# Altium project servo_pwr.PrjPcb
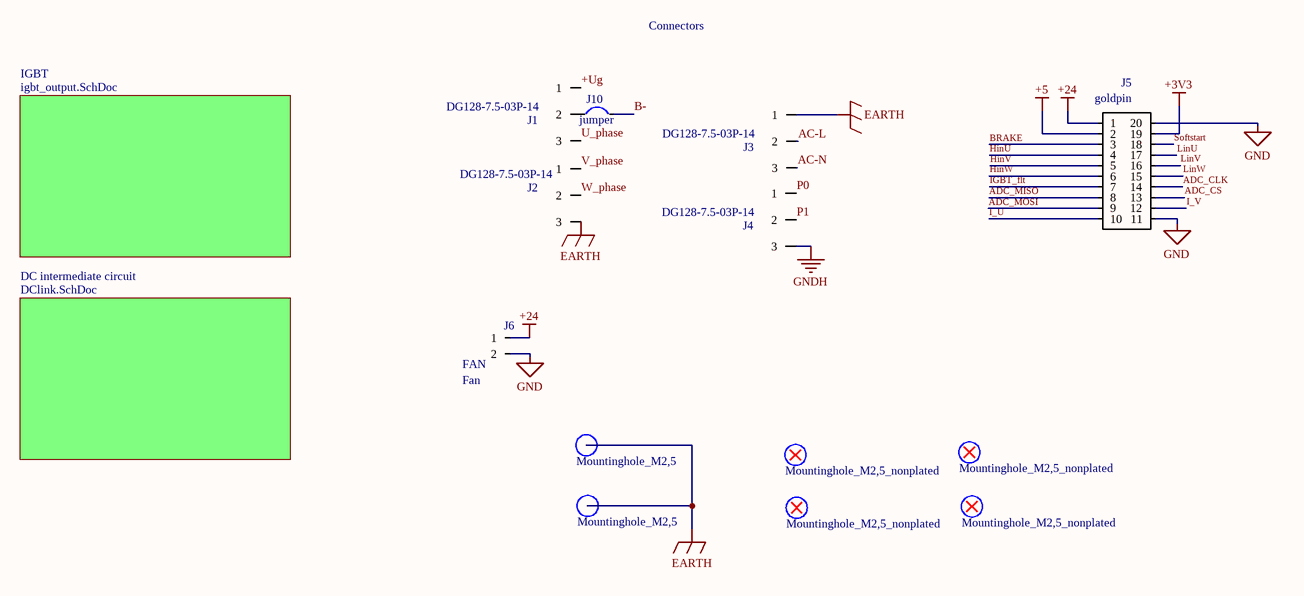
[diagram p0: servo_pwr.SchDoc]
3 sheets, 134 parts. Net scope: global (net labels, ports and power ports of the same name join across sheets).
Board file: servo_pwr.PcbDoc
Sheets:
  servo_pwr.SchDoc
    IGBT = igbt_output.SchDoc
    DC intermediate circuit = DClink.SchDoc

## Sheet servo_pwr.SchDoc: Servo power board
size A4; Organization: W Burdecki; Address1: github.com/wiciu15; Address2: All rights reserved; DocumentNumber: 1; Revision: 1.0; SheetNumber: 1; SheetTotal: 3

### Parts
J1  DG128-7.5-03P-14  [DG128-7.5-03P-14]
J2  DG128-7.5-03P-14  [DG128-7.5-03P-14]
J3  DG128-7.5-03P-14  [DG128-7.5-03P-14]
J4  DG128-7.5-03P-14  [DG128-7.5-03P-14]
J5  goldpin  [goldpin 2x10]
J6  FAN  [JST XH 2pin]
J10  jumper  [Jumper]
MH3  Mountinghole_M2,5  [Mountinghole M2,5]
MH4  Mountinghole_M2,5  [Mountinghole M2,5]
MH5  Mountinghole_M2,5_nonplated  [Mountinghole M2,5 non plated]
MH6  Mountinghole_M2,5_nonplated  [Mountinghole M2,5 non plated]
MH7  Mountinghole_M2,5_nonplated  [Mountinghole M2,5 non plated]
MH8  Mountinghole_M2,5_nonplated  [Mountinghole M2,5 non plated]

### Sub-sheets
DC intermediate circuit = DClink.SchDoc: no entries
IGBT = igbt_output.SchDoc: no entries

### Nets
+3V3: J5.19
+5: J5.2
+24: J5.1 J6.1
EARTH: J2.3 J3.1 MH3.1 MH4.1
GND: J5.11 J5.20 J6.2
GNDH: J4.3
+Ug: J1.1
AC-L: J3.2
AC-N: J3.3
ADC_CLK: J5.14
ADC_CS: J5.13
ADC_MISO: J5.8
ADC_MOSI: J5.9
B-: J10.1
BRAKE: J5.3
HinU: J5.4
HinV: J5.5
HinW: J5.6
I_U: J5.10
I_V: J5.12
IGBT_flt: J5.7
LinU: J5.17
LinV: J5.16
LinW: J5.15
P0: J4.1
P1: J4.2
Softstart: J5.18
U_phase: J1.3
V_phase: J2.1
W_phase: J2.2
NetJ1_2: J1.2 J10.2

Not connected (* = marked no-connect by the designer): MH5 1*; MH6 1*; MH7 1*; MH8 1*

### Notes on the sheet
- Connectors
- (near J6) Fan
- Title
- Size:
- Date:
- A4
- Number:
- Time:
- Revision:
- Sheet
- of
- File:

### Library data of the parts
J6 = JST 2pin

## Sheet igbt_output.SchDoc: Servo power board
size A3; Organization: W Burdecki; Address1: github.com/wiciu15; Address2: All rights reserved; DocumentNumber: 2; Revision: 1.0; SheetNumber: 2; SheetTotal: 3
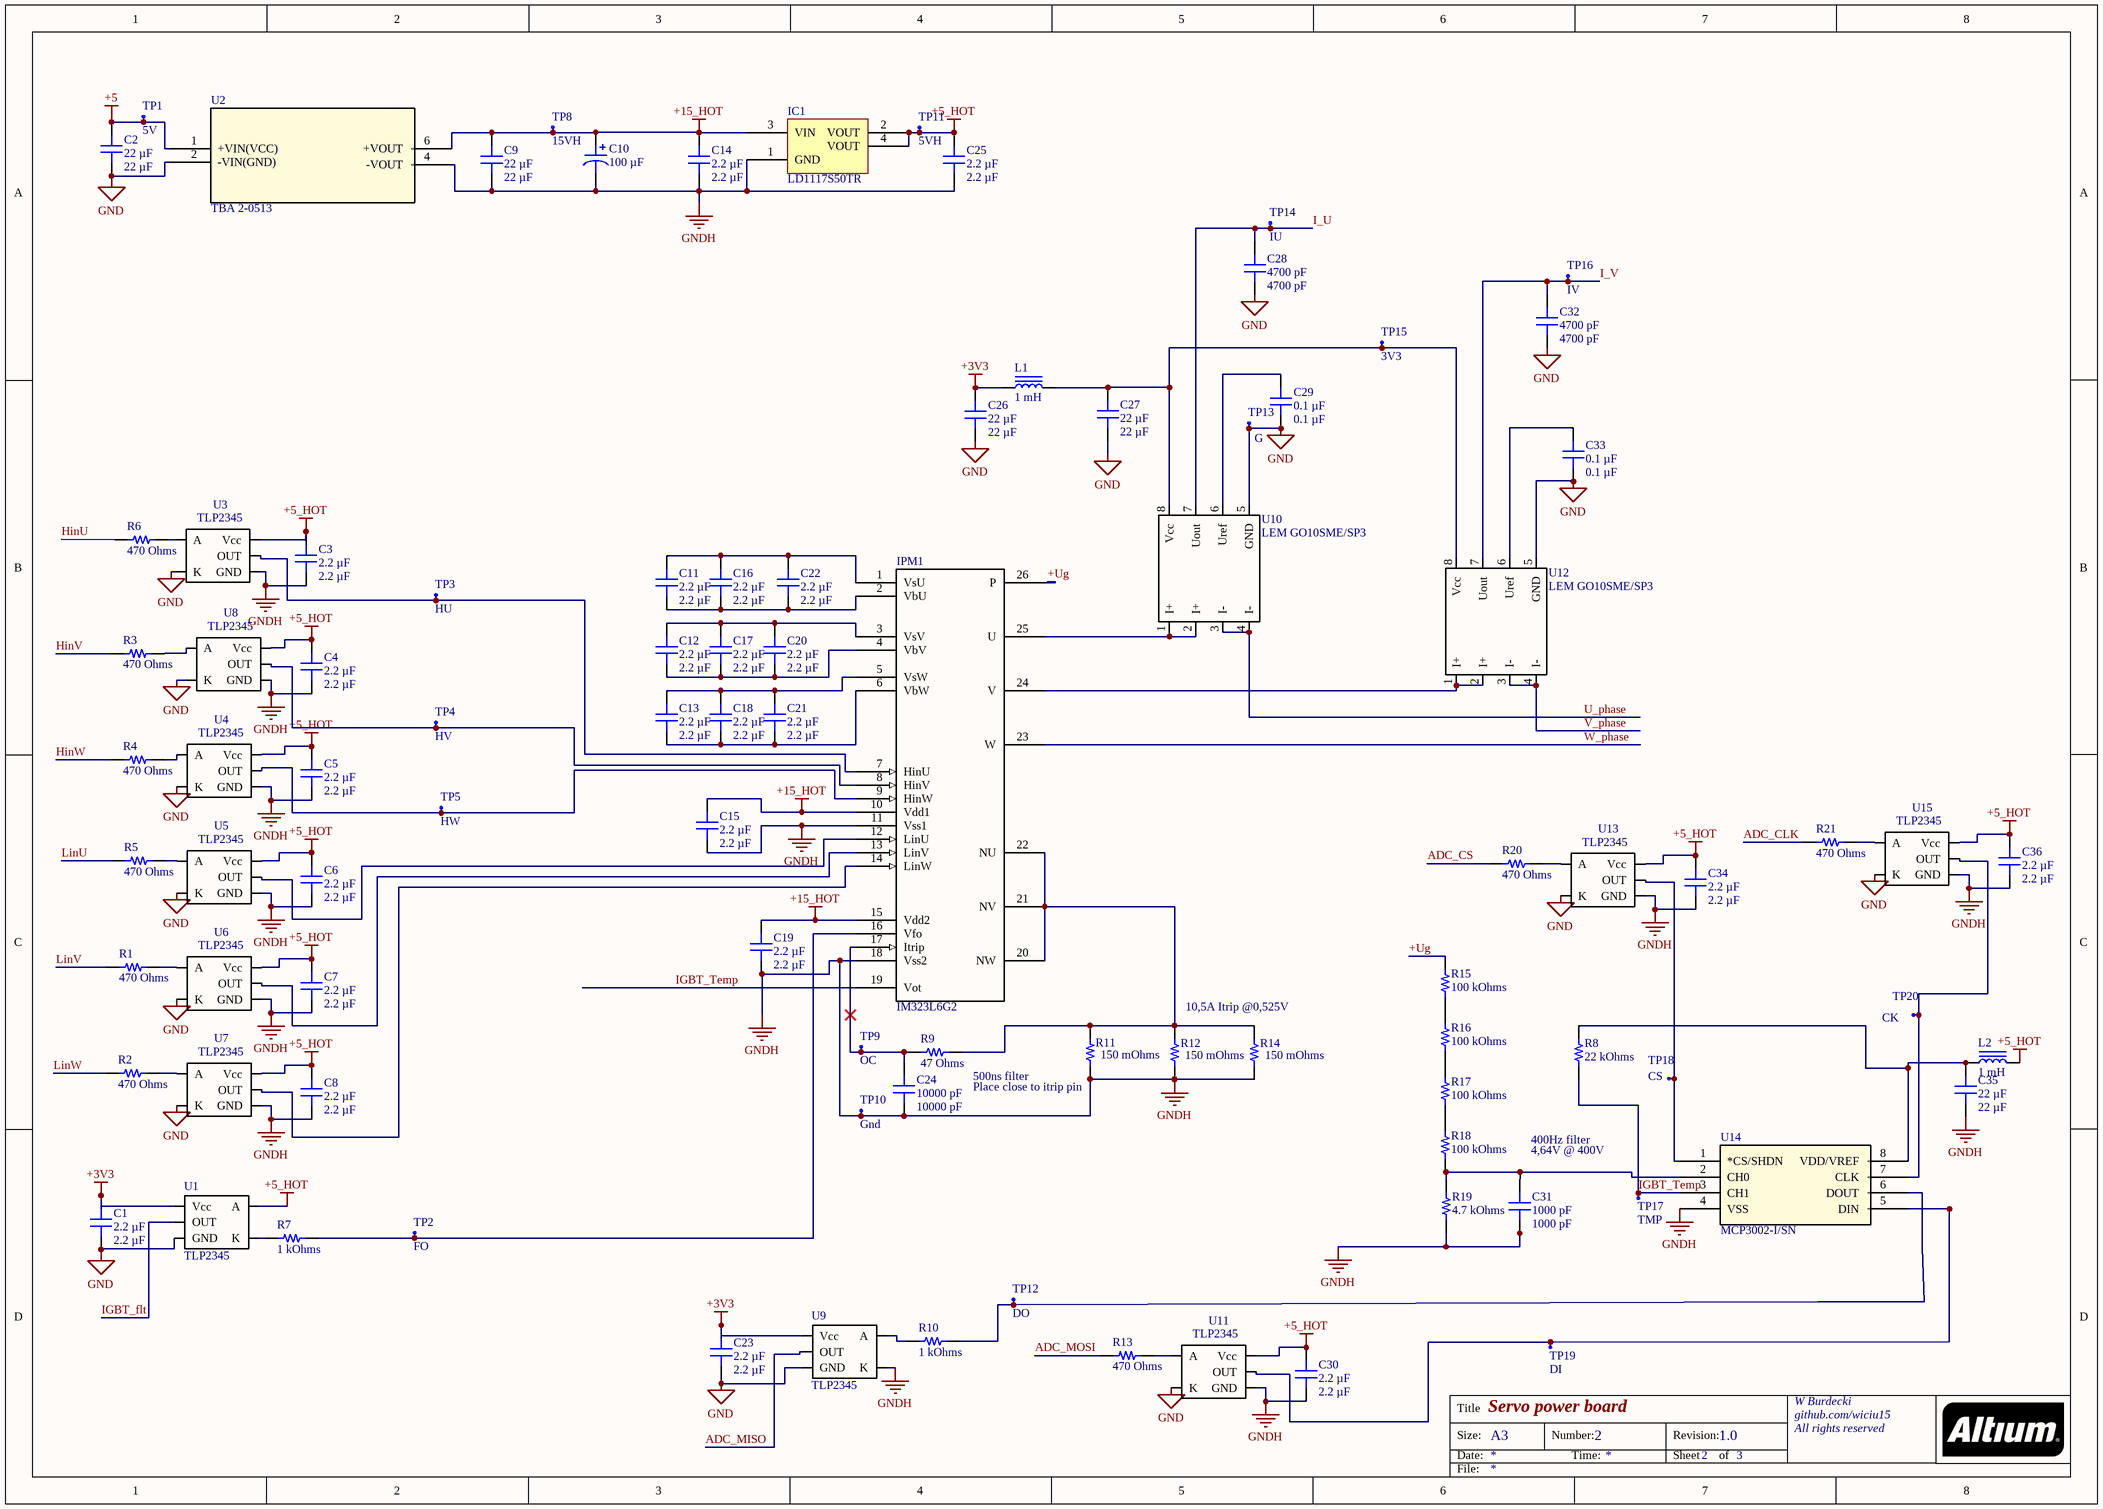
[diagram p1: igbt_output.SchDoc]

### Parts
C1  2.2 µF  [0805 wide]
C2  22 µF  [CAP 0805_2012]
C3  2.2 µF  [0805 wide]
C4  2.2 µF  [0805 wide]
C5  2.2 µF  [0805 wide]
C6  2.2 µF  [0805 wide]
C7  2.2 µF  [0805 wide]
C8  2.2 µF  [0805 wide]
C9  22 µF  [CAP 0805_2012]
C10  100 µF  [CAP AL TH D8 L3.5 H12.5]
C11  2.2 µF  [0805 wide]
C12  2.2 µF  [0805 wide]
C13  2.2 µF  [0805 wide]
C14  2.2 µF  [CAP 0805_2012]
C15  2.2 µF  [CAP 0805_2012]
C16  2.2 µF  [0805 wide]
C17  2.2 µF  [0805 wide]
C18  2.2 µF  [0805 wide]
C19  2.2 µF  [CAP 0805_2012]
C20  2.2 µF  [0805 wide]
C21  2.2 µF  [0805 wide]
C22  2.2 µF  [0805 wide]
C23  2.2 µF  [0805 wide]
C24  10000 pF  [CAP 0805_2012]
C25  2.2 µF  [CAP 0805_2012]
C26  22 µF  [CAP 0805_2012]
C27  22 µF  [0805 wide]
C28  4700 pF  [0805 wide]
C29  0.1 µF  [0805 wide]
C30  2.2 µF  [0805 wide]
C31  1000 pF  [CAP 0805_2012]
C32  4700 pF  [0805 wide]
C33  0.1 µF  [0805 wide]
C34  2.2 µF  [0805 wide]
C35  22 µF  [CAP 0805_2012]
C36  2.2 µF  [0805 wide]
IC1  LD1117S50TR  [ST SOT-223]
IPM1  IM323L6G2  [IM323L6G2]
L1  1 mH  [BOURNS SRR6028]
L2  1 mH  [BOURNS SRR6028]
R1  470 Ohms  [RES 0805_2012]
R2  470 Ohms  [RES 0805_2012]
R3  470 Ohms  [RES 0805_2012]
R4  470 Ohms  [RES 0805_2012]
R5  470 Ohms  [RES 0805_2012]
R6  470 Ohms  [RES 0805_2012]
R7  1 kOhms  [RES 0805_2012]
R8  22 kOhms  [RES 0805_2012]
R9  47 Ohms  [RES 0805_2012]
R10  1 kOhms  [RES 0805_2012]
R11  150 mOhms  [RES 2512_6432]
R12  150 mOhms  [RES 2512_6432]
R13  470 Ohms  [RES 0805_2012]
R14  150 mOhms  [RES 2512_6432]
R15  100 kOhms  [RES 1206_3216]
R16  100 kOhms  [RES 1206_3216]
R17  100 kOhms  [RES 1206_3216]
R18  100 kOhms  [RES 1206_3216]
R19  4.7 kOhms  [RES 1206_3216]
R20  470 Ohms  [RES 0805_2012]
R21  470 Ohms  [RES 0805_2012]
TP1  5V  [Testpoint1,2mm]
TP2  FO  [Testpoint1,2mm]
TP3  HU  [Testpoint1,2mm]
TP4  HV  [Testpoint1,2mm]
TP5  HW  [Testpoint1,2mm]
TP8  15VH  [Testpoint1,2mm]
TP9  OC  [Testpoint1,2mm]
TP10  Gnd  [Testpoint1,2mm]
TP11  5VH  [Testpoint1,2mm]
TP12  DO  [Testpoint1,2mm]
TP13  G  [Testpoint1,2mm]
TP14  IU  [Testpoint1,2mm]
TP15  3V3  [Testpoint1,2mm]
TP16  IV  [Testpoint1,2mm]
TP17  TMP  [Testpoint1,2mm]
TP18  CS  [Testpoint1,2mm]
TP19  DI  [Testpoint1,2mm]
TP20  CK  [Testpoint1,2mm]
U1  TLP2345  [TLP2345]
U2  TBA 2-0513  [TBA 2_SINGLE_TRP]
U3  TLP2345  [TLP2345]
U4  TLP2345  [TLP2345]
U5  TLP2345  [TLP2345]
U6  TLP2345  [TLP2345]
U7  TLP2345  [TLP2345]
U8  TLP2345  [TLP2345]
U9  TLP2345  [TLP2345]
U10  LEM GO10SME/SP3  [TSOP127P600X160-8N]
U11  TLP2345  [TLP2345]
U12  LEM GO10SME/SP3  [TSOP127P600X160-8N]
U13  TLP2345  [TLP2345]
U14  MCP3002-I/SN  [SOIC8-N_MC_MCH]
U15  TLP2345  [TLP2345]

### Nets
+3V3: C1.2 C23.2 C26.2 L1.1 U1.6(Vcc) U9.6(Vcc)
+5: C2.2 TP1.1 U2.1(+VIN(VCC))
+5_HOT: C3.2 C4.2 C5.2 C6.2 C7.2 C8.2 C25.2 C30.2 C34.2 C36.2 IC1.2(VOUT) IC1.4(VOUT) L2.2 TP11.1 U1.1(A) U3.6(Vcc) U4.6(Vcc) U5.6(Vcc) U6.6(Vcc) U7.6(Vcc) U8.6(Vcc) U11.6(Vcc) U13.6(Vcc) U15.6(Vcc)
+15_HOT: C9.2 C10.1 C14.2 C15.2 C19.2 IC1.3(VIN) IPM1.10(Vdd1) IPM1.15(Vdd2) TP8.1 U2.6(+VOUT)
GND: C1.1 C2.1 C23.1 C26.1 C27.1 C28.1 C29.1 C32.1 C33.1 TP13.1 U1.4(GND) U2.2(-VIN(GND)) U3.3(K) U4.3(K) U5.3(K) U6.3(K) U7.3(K) U8.3(K) U9.4(GND) U10.5(GND) U11.3(K) U12.5(GND) U13.3(K) U15.3(K)
GNDH: C3.1 C4.1 C5.1 C6.1 C7.1 C8.1 C9.1 C10.2 C14.1 C15.1 C19.1 C24.1 C25.1 C30.1 C31.1 C34.1 C35.1 C36.1 IC1.1(GND) IPM1.11(Vss1) IPM1.18(Vss2) R11.1 R12.1 R14.1 R19.1 TP10.1 U2.4(-VOUT) U3.4(GND) U4.4(GND) U5.4(GND) U6.4(GND) U7.4(GND) U8.4(GND) U9.3(K) U11.4(GND) U13.4(GND) U14.4(VSS) U15.4(GND)
+Ug: IPM1.26(P) R15.2
ADC_CLK: R21.1
ADC_CS: R20.1
ADC_MISO: U9.5(OUT)
ADC_MOSI: R13.1
HinU: R6.1
HinV: R3.1
HinW: R4.1
I_U: C28.2 TP14.1 U10.7(Uout)
I_V: C32.2 TP16.1 U12.7(Uout)
IGBT_flt: U1.5(OUT)
IGBT_Temp: IPM1.19(Vot) R8.1 TP17.1 U14.3(CH1)
LinU: R5.1
LinV: R1.1
LinW: R2.1
U_phase: U10.3(I-) U10.4(I-)
V_phase: U12.3(I-) U12.4(I-)
W_phase: IPM1.23(W)
NetC11_1: C11.1 C16.1 C22.1 IPM1.2(VbU)
NetC11_2: C11.2 C16.2 C22.2 IPM1.1(VsU)
NetC12_1: C12.1 C17.1 C20.1 IPM1.4(VbV)
NetC12_2: C12.2 C17.2 C20.2 IPM1.3(VsV)
NetC13_1: C13.1 C18.1 C21.1 IPM1.6(VbW)
NetC13_2: C13.2 C18.2 C21.2 IPM1.5(VsW)
NetC24_2: C24.2 IPM1.17(Itrip) R9.1 TP9.1
NetC27_2: C27.2 L1.2 TP15.1 U10.8(Vcc) U12.8(Vcc)
NetC29_2: C29.2 U10.6(Uref)
NetC31_2: C31.2 R18.1 R19.2 U14.2(CH0)
NetC33_2: C33.2 U12.6(Uref)
NetC35_2: C35.2 L2.1 R8.2 U14.8(VDD/VREF)
NetIPM1_7: IPM1.7(HinU) TP3.1 U3.5(OUT)
NetIPM1_8: IPM1.8(HinV) TP4.1 U8.5(OUT)
NetIPM1_9: IPM1.9(HinW) TP5.1 U4.5(OUT)
NetIPM1_12: IPM1.12(LinU) U5.5(OUT)
NetIPM1_13: IPM1.13(LinV) U6.5(OUT)
NetIPM1_14: IPM1.14(LinW) U7.5(OUT)
NetIPM1_16: IPM1.16(Vfo) R7.2 TP2.1
NetIPM1_20: IPM1.20(NW) IPM1.21(NV) IPM1.22(NU) R9.2 R11.2 R12.2 R14.2
NetIPM1_24: IPM1.24(V) U12.1(I+) U12.2(I+)
NetIPM1_25: IPM1.25(U) U10.1(I+) U10.2(I+)
NetR1_2: R1.2 U6.1(A)
NetR2_2: R2.2 U7.1(A)
NetR3_2: R3.2 U8.1(A)
NetR4_2: R4.2 U4.1(A)
NetR5_2: R5.2 U5.1(A)
NetR6_2: R6.2 U3.1(A)
NetR7_1: R7.1 U1.3(K)
NetR10_1: R10.1 U9.1(A)
NetR10_2: R10.2 TP12.1 U14.6(DOUT)
NetR13_2: R13.2 U11.1(A)
NetR15_1: R15.1 R16.2
NetR16_1: R16.1 R17.2
NetR17_1: R17.1 R18.2
NetR20_2: R20.2 U13.1(A)
NetR21_2: R21.2 U15.1(A)
NetTP18_1: TP18.1 U13.5(OUT) U14.1(*CS/SHDN)
NetTP19_1: TP19.1 U11.5(OUT) U14.5(DIN)
NetTP20_1: TP20.1 U14.7(CLK) U15.5(OUT)

### Notes on the sheet
- 10,5A Itrip @0,525V
- 500ns filter
- (near R11) Place close to itrip pin
- 4,64V @ 400V
- 400Hz filter
- Title
- Size:
- Date:
- A3
- Number:
- Time:
- Revision:
- Sheet
- of
- File:

### Library data of the parts
C1 C3-C8 C11-C23 C25 C30 C34 C36 = C2012X7R1V225K125AB: CAP CER 2.2UF 35V X7R 0805; manufacturer: TDK Corporation; Tolerance: ±10%; Part Number: C2012X7R1V225K125AB; Value: 2.2 µF; Applications: General Purpose; Capacitance: 2.2 µF; componentlink1description: Datasheet; componentlink1url: https://product.tdk.com/info/en/catalog/datasheets/mlcc_commercial_general_en.pdf?ref_disty=digikey; componentlink2description: DigiKey Link; componentlink2url: https://www.digikey.com/en/products/detail/tdk-corporation/C2012X7R1V225K125AB/2732986; Device Package: 0805 (2012 Metric); lastupdated: 03.01.2023 20:10:54; Lifecycle Status: Active; Minimum Order: 1; Mounting Type: Surface Mount, MLCC; Operating Temperature: -55°C ~ 125°C; Package / Case: 0805 (2012 Metric); packaging: TapeAndReel; partid: 3412; Part Status: Active; price: 0.12; series: C; Size / Dimension: 0.079" L x 0.049" W (2.00mm x 1.25mm); Supplier 1: DigiKey; Supplier Part Number 1: 445-7551-1-ND; Temperature Coefficient: X7R; Thickness (Max): 0.057" (1.45mm); Voltage - Rated: 35V; Features: Low ESL
C2 C9 C26 C27 C35 = CL21A226KOQNNNG: CAP CER 22UF 16V X5R 0805; manufacturer: Samsung Electro-Mechanics; Tolerance: ±10%; Part Number: CL21A226KOQNNNG; Value: 22 µF; Applications: General Purpose; Capacitance: 22 µF; componentlink1description: Datasheet; componentlink1url: //media.digikey.com/pdf/Data%20Sheets/Samsung%20PDFs/CL21A226KOQNNNG_Spec.pdf; componentlink2description: DigiKey Link; componentlink2url: https://www.digikey.com/en/products/detail/samsung-electro-mechanics/CL21A226KOQNNNG/3894433; Device Package: 0805 (2012 Metric); lastupdated: 03.01.2023 20:10:55; Lifecycle Status: Active; Minimum Order: 1; Mounting Type: Surface Mount, MLCC; Operating Temperature: -55°C ~ 85°C; Package / Case: 0805 (2012 Metric); packaging: TapeAndReel; partid: 3000; Part Status: Active; price: 0.06; series: CL; Size / Dimension: 0.079" L x 0.049" W (2.00mm x 1.25mm); Supplier 1: DigiKey; Supplier Part Number 1: 1276-7092-1-ND; Temperature Coefficient: X5R; Thickness (Max): 0.055" (1.40mm); Voltage - Rated: 16V
C10 = EEU-TA1E101: CAP ALUM 100UF 20% 25V RADIAL; manufacturer: Panasonic Electronic Components; Impedance: 130 mOhms; Lifetime @ Temp.: 2000 Hrs @ 125°C; Polarization: Polar; Ripple Current @ High Frequency: 500 mA @ 100 kHz; Ripple Current @ Low Frequency: 325 mA @ 120 Hz; Part Number: EEU-TA1E101; Applications: General Purpose; Capacitance: 100 µF; componentlink1description: Datasheet; componentlink1url: http://industrial.panasonic.com/www-cgi/jvcr13pz.cgi?E+PZ+3+ABA0028+EEUTA1E101+8+WW; componentlink2description: DigiKey Link; componentlink2url: https://www.digikey.com/en/products/detail/panasonic-electronic-components/EEU-TA1E101/2689893; Device Package: Radial, Can; Height - Seated (Max): 0.492" (12.50mm); lastupdated: 02.01.2023 21:00:54; Lead Spacing: 0.138" (3.50mm); Lifecycle Status: Active; Minimum Order: 1; Mounting Type: Through Hole; Operating Temperature: -40°C ~ 125°C; Package / Case: Radial, Can; packaging: Bulk; partid: 7202; Part Status: Active; price: 0.31; series: TA; Size / Dimension: 0.315" Dia (8.00mm); Supplier 1: DigiKey; Supplier Part Number 1: P19501-ND; Tolerance: ±20%; value: 100 µF; Voltage - Rated: 25 V
C24 = C0805C103K5RECAUTO: CAP CER 0805 10NF 50V X7R 10%; manufacturer: KEMET; Part Number: C0805C103K5RECAUTO; Value: 10000 pF; Applications: Automotive, ESD Protection; Capacitance: 10000 pF; componentlink1description: Datasheet; componentlink1url: https://api.kemet.com/component-edge/download/datasheet/C0805C103K5RECAUTO.pdf; componentlink2description: DigiKey Link; componentlink2url: https://www.digikey.com/en/products/detail/kemet/C0805C103K5RECAUTO/8640479; Device Package: 0805 (2012 Metric); lastupdated: 03.01.2023 20:10:42; Lifecycle Status: Active; Minimum Order: 1; Mounting Type: Surface Mount, MLCC; Operating Temperature: -55°C ~ 125°C; Package / Case: 0805 (2012 Metric); packaging: TapeAndReel; partid: 8498; Part Status: Active; price: 0.04; Ratings: AEC-Q200; series: ESD SMD Auto X7R; Size / Dimension: 0.079" L x 0.049" W (2.00mm x 1.25mm); Supplier 1: DigiKey; Supplier Part Number 1: 399-17885-1-ND; Temperature Coefficient: X7R; Thickness (Max): 0.035" (0.88mm); Tolerance: ±10%; Voltage - Rated: 50V
C28 C32 = C0805C472K5RECAUTO: CAP CER 0805 4.7NF 50V X7R 10%; manufacturer: KEMET; Part Number: C0805C472K5RECAUTO; Value: 4700 pF; Applications: Automotive, ESD Protection; Capacitance: 4700 pF; componentlink1description: Datasheet; componentlink1url: https://api.kemet.com/component-edge/download/datasheet/C0805C472K5RECAUTO.pdf; componentlink2description: DigiKey Link; componentlink2url: https://www.digikey.com/en/products/detail/kemet/C0805C472K5RECAUTO/8640478; Device Package: 0805 (2012 Metric); lastupdated: 03.01.2023 20:10:48; Lifecycle Status: Active; Minimum Order: 1; Mounting Type: Surface Mount, MLCC; Operating Temperature: -55°C ~ 125°C; Package / Case: 0805 (2012 Metric); packaging: TapeAndReel; partid: 5836; Part Status: Active; price: 0.04; Ratings: AEC-Q200; series: ESD SMD Auto X7R; Size / Dimension: 0.079" L x 0.049" W (2.00mm x 1.25mm); Supplier 1: DigiKey; Supplier Part Number 1: 399-17884-1-ND; Temperature Coefficient: X7R; Thickness (Max): 0.035" (0.88mm); Tolerance: ±10%; Voltage - Rated: 50V
C29 C33 = CC0805MRX7R9BB104: CAP CER 0.1UF 50V X7R 0805; manufacturer: Yageo; Tolerance: ±20%; Part Number: CC0805MRX7R9BB104; Value: 0.1 µF; Applications: General Purpose; Capacitance: 0.1 µF; componentlink1description: Datasheet; componentlink1url: https://www.yageo.com/upload/media/product/productsearch/datasheet/mlcc/UPY-GPHC_X7R_6.3V-to-50V_18.pdf; componentlink2description: DigiKey Link; componentlink2url: https://www.digikey.com/en/products/detail/yageo/CC0805MRX7R9BB104/5884281; Device Package: 0805 (2012 Metric); lastupdated: 03.01.2023 20:10:56; Lifecycle Status: Active; Minimum Order: 1; Mounting Type: Surface Mount, MLCC; Operating Temperature: -55°C ~ 125°C; Package / Case: 0805 (2012 Metric); packaging: TapeAndReel; partid: 2475; Part Status: Active; price: 0.02; series: CC; Size / Dimension: 0.079" L x 0.049" W (2.00mm x 1.25mm); Supplier 1: DigiKey; Supplier Part Number 1: 311-4351-1-ND; Temperature Coefficient: X7R; Thickness (Max): 0.037" (0.95mm); Voltage - Rated: 50V
C31 = C0805X102J5HACAUTO: CAP CER 0805 1NF 50V ULTRA STABL; manufacturer: KEMET; Temperature Coefficient: X8R; Tolerance: ±5%; Part Number: C0805X102J5HACAUTO; Value: 1000 pF; Applications: Automotive, Boardflex Sensitive; Capacitance: 1000 pF; componentlink1description: Datasheet; componentlink1url: https://api.kemet.com/component-edge/download/datasheet/C0805X102J5HACAUTO.pdf; componentlink2description: DigiKey Link; componentlink2url: https://www.digikey.com/en/products/detail/kemet/C0805X102J5HACAUTO/8324462; Device Package: 0805 (2012 Metric); Features: Low ESL, Soft Termination, High Temperature; lastupdated: 03.01.2023 20:10:49; Lifecycle Status: Active; Minimum Order: 1; Mounting Type: Surface Mount, MLCC; Operating Temperature: -55°C ~ 150°C; Package / Case: 0805 (2012 Metric); packaging: TapeAndReel; partid: 5533; Part Status: Active; price: 0.03; Ratings: AEC-Q200; series: SMD Auto X8R HT150C Flex; Size / Dimension: 0.079" L x 0.049" W (2.00mm x 1.25mm); Supplier 1: DigiKey; Supplier Part Number 1: 399-16876-1-ND; Thickness (Max): 0.039" (0.98mm); Voltage - Rated: 50V
IC1 = LD1117S50TR: IC REG LINEAR 5V 800MA SOT223; Manufacturer: STMicroelectronics; Current - Quiescent (Iq): 10 mA; Number of Regulators: 1; Output Configuration: Positive; Output Type: Fixed; Protection Features: Over Current, Over Temperature; PSRR: 75dB (120Hz); Voltage Dropout (Max): 1.2V @ 800mA; Voltage - Input (Max): 15V; Part Number: LD1117S50TR; ComponentLink1Description: Datasheet; ComponentLink1URL: http://www.st.com/content/ccc/resource/technical/document/datasheet/99/3b/7d/91/91/51/4b/be/CD00000544.pdf/files/CD00000544.pdf/jcr:content/translations/en.CD00000544.pdf; ComponentLink2Description: DigiKey Link; ComponentLink2URL: https://www.digikey.com/en/products/detail/stmicroelectronics/LD1117S50TR/1038360; Current - Output: 800mA; LastUpdated: 02.01.2023 21:04:19; Lifecycle Status: Active; Minimum Order: 1; Mounting Type: Surface Mount; Operating Temperature: 0°C ~ 125°C; Package / Case: TO-261-4, TO-261AA; Packaging: TapeAndReel; Part Status: Active; Price: 0.25; Series: -; Supplier 1: DigiKey; Supplier Part Number 1: 497-6447-1-ND; Supplier Device Package: SOT-223; Voltage - Output (Min/Fixed): 5V
L1 L2 = SRR6028-102Y: FIXED IND 1MH 150MA 4.5 OHM SMD; Manufacturer: Bourns Inc.; Current - Saturation: 170mA; DC Resistance (DCR): 4.5Ohm Max; Frequency - Self Resonant: 7MHz; Inductance Frequency - Test: 100 kHz; Material - Core: Ferrite; Q @ Freq: 32 @ 252kHz; Shielding: Shielded; Tolerance: ±30%; Type: Drum Core, Wirewound; Part Number: SRR6028-102Y; ComponentLink1Description: Datasheet; ComponentLink1URL: https://www.bourns.com/docs/Product-Datasheets/SRR6028.pdf; ComponentLink2Description: DigiKey Link; ComponentLink2URL: https://www.digikey.com/en/products/detail/bourns-inc/SRR6028-102Y/2563578; Current Rating (Amps): 150 mA; Device Package: Nonstandard; Height - Seated (Max): 0.118" (3.00mm); Inductance: 1 mH; LastUpdated: 02.01.2023 20:58:53; Lifecycle Status: Active; Minimum Order: 1; Mounting Type: Surface Mount; Operating Temperature: -40°C ~ 125°C; Package / Case: Nonstandard; Packaging: TapeAndReel; PartId: 60; Part Status: Active; Price: 0.34; Series: SRR6028; Size / Dimension: 0.268" L x 0.268" W (6.80mm x 6.80mm); Supplier 1: DigiKey; Supplier Part Number 1: SRR6028-102YCT-ND; Value: 1 mH
R1-R6 R13 R20 R21 = ERJ-PB6B4700V: RES SMD 470 OHM 0.1% 1/4W 0805; Manufacturer: Panasonic Electronic Components; Power (Watts): 0.25W, 1/4W; Temperature Coefficient: ±50ppm/°C; Part Number: ERJ-PB6B4700V; Value: 470 Ohms; ComponentLink1Description: Datasheet; ComponentLink1URL: https://industrial.panasonic.com/cdbs/www-data/pdf/RDM0000/AOA0000C328.pdf; ComponentLink2Description: DigiKey Link; ComponentLink2URL: https://www.digikey.com/en/products/detail/panasonic-electronic-components/ERJ-PB6B4700V/6213339; Composition: Thick Film; Device Package: 0805 (2012 Metric); Features: Automotive AEC-Q200, Pulse Withstanding; Height - Seated (Max): 0.028" (0.70mm); LastUpdated: 02.01.2023 20:44:49; Lifecycle Status: Active; Minimum Order: 1; Number of Terminations: 2; Operating Temperature: -55°C ~ 155°C; Package / Case: 0805 (2012 Metric); Packaging: TapeAndReel; PartId: 28402; Part Status: Active; Price: 0.04; Ratings: AEC-Q200; Resistance: 470 Ohms; Series: ERJ-PB6; Size / Dimension: 0.079" L x 0.049" W (2.00mm x 1.25mm); Supplier 1: DigiKey; Supplier Part Number 1: P20556CT-ND; Supplier Device Package: 0805; Tolerance: ±0.1%
R7 R10 = RNCS0805BKE1K00: RES 1K OHM 0.1% 1/10W 0805; Manufacturer: Stackpole Electronics Inc; Power (Watts): 0.1W, 1/10W; Temperature Coefficient: ±25ppm/°C; Part Number: RNCS0805BKE1K00; Value: 1 kOhms; ComponentLink1Description: Datasheet; ComponentLink1URL: https://www.seielect.com/catalog/sei-rncs_rnch.pdf; ComponentLink2Description: DigiKey Link; ComponentLink2URL: https://www.digikey.com/en/products/detail/stackpole-electronics-inc/RNCS0805BKE1K00/1800073; Composition: Thin Film; Device Package: 0805 (2012 Metric); Features: Anti-Corrosive, Automotive AEC-Q200, Moisture Resistant; Height - Seated (Max): 0.026" (0.65mm); LastUpdated: 02.01.2023 20:44:52; Lifecycle Status: Active; Minimum Order: 1; Number of Terminations: 2; Operating Temperature: -55°C ~ 155°C; Package / Case: 0805 (2012 Metric); Packaging: TapeAndReel; PartId: 27715; Part Status: Active; Price: 0.09; Ratings: AEC-Q200; Resistance: 1 kOhms; Series: RNCS; Size / Dimension: 0.079" L x 0.049" W (2.00mm x 1.25mm); Supplier 1: DigiKey; Supplier Part Number 1: RNCS0805BKE1K00CT-ND; Supplier Device Package: 0805; Tolerance: ±0.1%
R8 = CRGCQ0805J22K: RES 22K OHM 5% 1/8W 0805; Manufacturer: TE Connectivity Passive Product; Power (Watts): 0.125W, 1/8W; Temperature Coefficient: ±100ppm/°C; Part Number: CRGCQ0805J22K; Value: 22 kOhms; ComponentLink1Description: Datasheet; ComponentLink1URL: https://www.te.com/commerce/DocumentDelivery/DDEController?Action=srchrtrv&DocNm=1773204-3&DocType=DS&DocLang=English; ComponentLink2Description: DigiKey Link; ComponentLink2URL: https://www.digikey.com/en/products/detail/te-connectivity-passive-product/CRGCQ0805J22K/8576744; Composition: Thick Film; Device Package: 0805 (2012 Metric); Features: Automotive AEC-Q200, Moisture Resistant; Height - Seated (Max): 0.026" (0.65mm); LastUpdated: 02.01.2023 20:44:45; Lifecycle Status: Active; Minimum Order: 1; Number of Terminations: 2; Operating Temperature: -55°C ~ 155°C; Package / Case: 0805 (2012 Metric); Packaging: TapeAndReel; PartId: 29521; Part Status: Active; Price: 0.01; Resistance: 22 kOhms; Series: CRGCQ; Size / Dimension: 0.079" L x 0.049" W (2.00mm x 1.25mm); Supplier 1: DigiKey; Supplier Part Number 1: A130142CT-ND; Supplier Device Package: 0805; Tolerance: ±5%; Ratings: AEC-Q200
R9 = CRGP0805F47R: RES 47 OHM 1% 1/3W 0805; Manufacturer: TE Connectivity Passive Product; Power (Watts): 0.333W, 1/3W; Temperature Coefficient: ±200ppm/°C; Part Number: CRGP0805F47R; Value: 47 Ohms; ComponentLink1Description: Datasheet; ComponentLink1URL: https://www.te.com/commerce/DocumentDelivery/DDEController?Action=srchrtrv&DocNm=9-1773463-9&DocType=DS&DocLang=English; ComponentLink2Description: DigiKey Link; ComponentLink2URL: https://www.digikey.com/en/products/detail/te-connectivity-passive-product/CRGP0805F47R/8577063; Composition: Thick Film; Device Package: 0805 (2012 Metric); Features: Pulse Withstanding; Height - Seated (Max): 0.026" (0.65mm); LastUpdated: 02.01.2023 20:44:48; Lifecycle Status: Active; Minimum Order: 1; Number of Terminations: 2; Operating Temperature: -55°C ~ 155°C; Package / Case: 0805 (2012 Metric); Packaging: TapeAndReel; PartId: 28763; Part Status: Active; Price: 0.03; Resistance: 47 Ohms; Series: CRGP; Size / Dimension: 0.079" L x 0.049" W (2.00mm x 1.25mm); Supplier 1: DigiKey; Supplier Part Number 1: A130461CT-ND; Supplier Device Package: 0805; Tolerance: ±1%
R11 R12 R14 = TLRH3AWTTER150F: RES 150M OHM 1% 2W 2512; Manufacturer: KOA Speer Electronics, Inc.; Temperature Coefficient: ±50ppm/°C; Part Number: TLRH3AWTTER150F; ComponentLink1Description: Datasheet; ComponentLink1URL: http://www.koaspeer.com/catimages/Products/TLRH/TLRH.pdf; ComponentLink2Description: DigiKey Link; ComponentLink2URL: http://digikey.com/product-detail/en/koa-speer-electronics-inc/TLRH3AWTTER150F/2019-TLRH3AWTTER150FCT-ND/9847534; Composition: Metal Element; Device Package: 2512 (6432 Metric); Features: Automotive AEC-Q200, Current Sense; Height - Seated (Max): 0.028" (0.70mm); LastUpdated: 02.09.2020 01:27:01; Lifecycle Status: Active; Minimum Order: 1; Number of Terminations: 2; Operating Temperature: -65°C ~ 170°C; Package / Case: 2512 (6432 Metric); Packaging: TapeAndReel; Part Status: Active; Power (Watts): 2W; Price: 0.57; Ratings: AEC-Q200; Resistance: 150 mOhms; Series: TLRH; Size / Dimension: 0.248" L x 0.126" W (6.30mm x 3.20mm); Supplier 1: DigiKey; Supplier Part Number 1: 2019-TLRH3AWTTER150FCT-ND; Supplier Device Package: 2512; Tolerance: ±1%; Value: 150 mOhms
R15-R18 = RT1206BRB07100KL: RES SMD 100K OHM 0.1% 1/4W 1206; Manufacturer: Yageo; Power (Watts): 0.25W, 1/4W; Temperature Coefficient: ±10ppm/°C; Part Number: RT1206BRB07100KL; ComponentLink1Description: Datasheet; ComponentLink1URL: https://www.yageo.com/upload/media/product/productsearch/datasheet/rchip/PYu-RT_1-to-0.01_RoHS_L_11.pdf; ComponentLink2Description: DigiKey Link; ComponentLink2URL: https://www.digikey.com/en/products/detail/yageo/RT1206BRB07100KL/5936250; Composition: Thin Film; Device Package: 1206 (3216 Metric); Height - Seated (Max): 0.026" (0.65mm); LastUpdated: 02.01.2023 20:37:38; Lifecycle Status: Active; Minimum Order: 1; Number of Terminations: 2; Operating Temperature: -55°C ~ 155°C; Package / Case: 1206 (3216 Metric); Packaging: TapeAndReel; PartId: 26928; Part Status: Active; Price: 0.23; Resistance: 100 kOhms; Series: RT; Size / Dimension: 0.122" L x 0.063" W (3.10mm x 1.60mm); Supplier 1: DigiKey; Supplier Part Number 1: YAG5016CT-ND; Supplier Device Package: 1206; Tolerance: ±0.1%; Value: 100 kOhms
R19 = CRG1206F4K7: RES SMD 4.7K OHM 1% 1/4W 1206; Manufacturer: TE Connectivity Passive Product; Power (Watts): 0.25W, 1/4W; Temperature Coefficient: ±100ppm/°C; Part Number: CRG1206F4K7; ComponentLink1Description: Datasheet; ComponentLink1URL: https://www.te.com/commerce/DocumentDelivery/DDEController?Action=srchrtrv&DocNm=1773204&DocType=DS&DocLang=English; ComponentLink2Description: DigiKey Link; ComponentLink2URL: https://www.digikey.com/en/products/detail/te-connectivity-passive-product/CRG1206F4K7/2381014; Composition: Thick Film; Device Package: 1206 (3216 Metric); Height - Seated (Max): 0.026" (0.65mm); LastUpdated: 02.01.2023 20:37:38; Lifecycle Status: Active; Minimum Order: 1; Number of Terminations: 2; Operating Temperature: -55°C ~ 155°C; Package / Case: 1206 (3216 Metric); Packaging: TapeAndReel; PartId: 26987; Part Status: Active; Price: 0.01; Resistance: 4.7 kOhms; Series: CRG, Neohm; Size / Dimension: 0.122" L x 0.061" W (3.10mm x 1.55mm); Supplier 1: DigiKey; Supplier Part Number 1: A106078CT-ND; Supplier Device Package: 1206; Tolerance: ±1%; Value: 4.7 kOhms
TP1-TP5 TP8-TP20 = Testpoint
U2 = TBA 2-0513: No Description Available; Mfr_Name: Traco Power; Copyright: Copyright (C) 2022 Ultra Librarian. All rights reserved.; Manufacturer_Part_Number: TBA 2-0513; Digi-Key_Part_Number_1: 1951-3431-ND; RefDes: RefDes; Type: DEV
U14 = MCP3002-I/SN: No Description Available; Mfr_Name: Microchip; Copyright: Copyright (C) 2022 Ultra Librarian. All rights reserved.; Manufacturer_Part_Number: MCP3002-I/SN; RefDes: RefDes; Type: DEV
IPM1 = IM323L6G2: Parameter 1: *

## Sheet DClink.SchDoc: Servo power board
size A4; github.com/wiciu15: L3, 12a Rodborough Rd; Organization: W Burdecki; Address1: github.com/wiciu15; Address2: All rights reserved; DocumentNumber: 3; Revision: 1.0; SheetNumber: 3; SheetTotal: 3
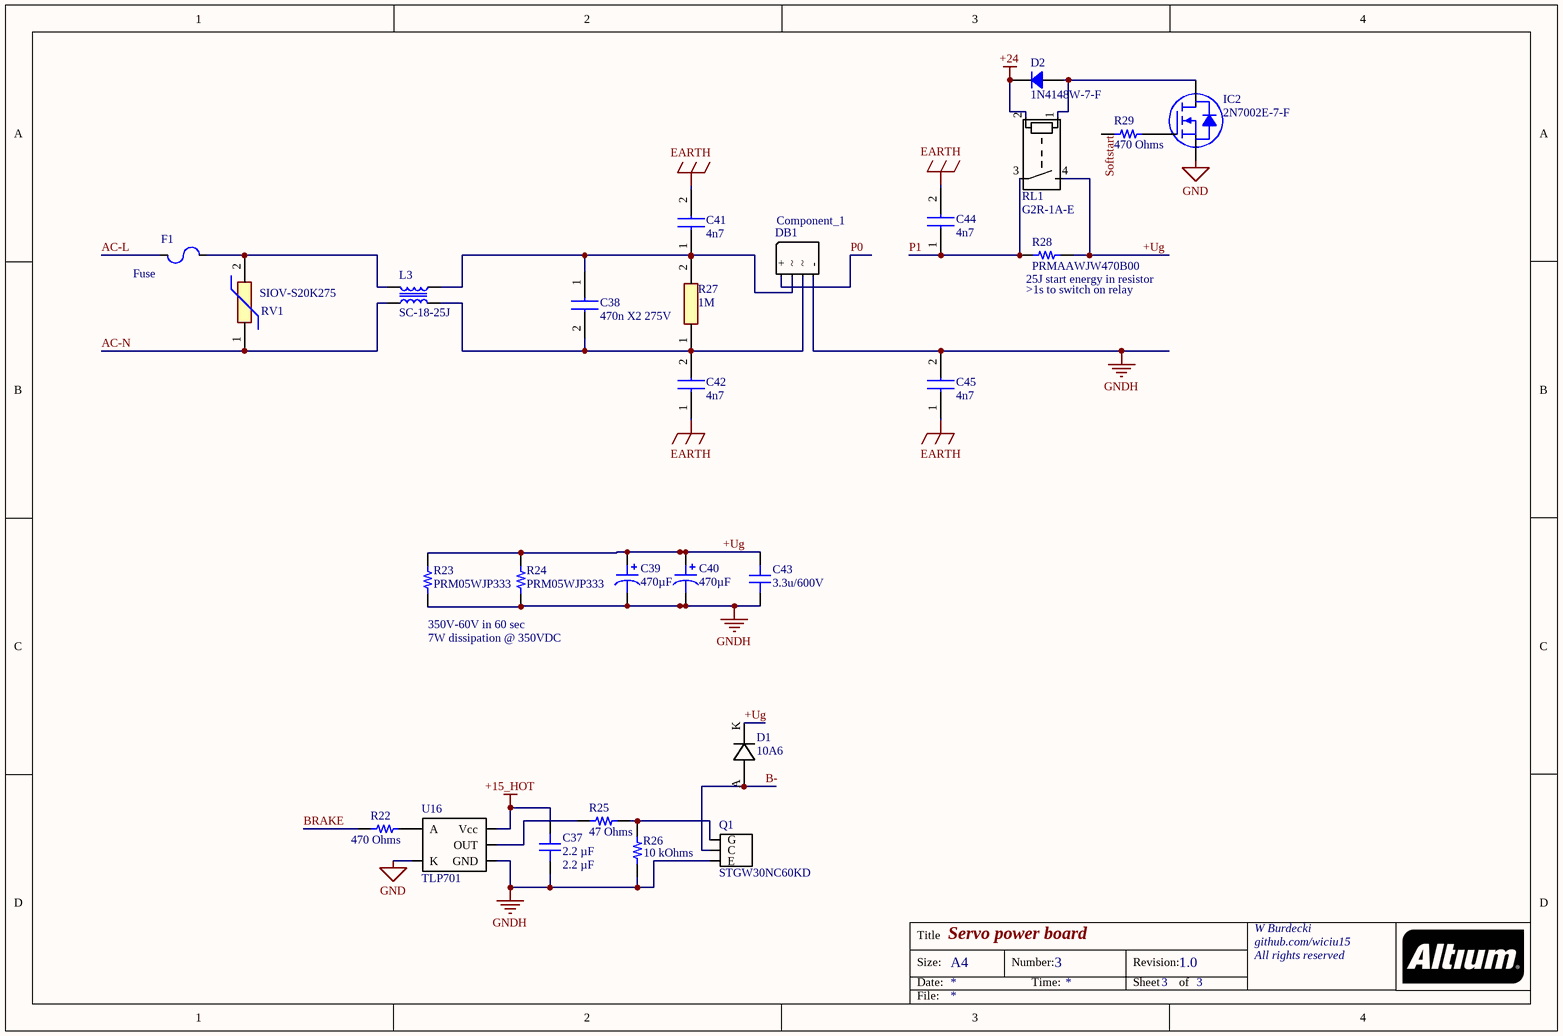
[diagram p2: DClink.SchDoc]

### Parts
C37  2.2 µF  [CAP 0805_2012]
C38  470n X2 275V  [R46KI347050M1K]
C39  470µF  [CAP TH ALUM ELEC D35.00mm S10.00mm H47.00mm]
C40  470µF  [CAP TH ALUM ELEC D35.00mm S10.00mm H47.00mm]
C41  4n7  [B32021_(13_x_5)]
C42  4n7  [B32021_(13_x_5)]
C43  3.3u/600V  [C4AQHBU4330P1WJ]
C44  4n7  [B32021_(13_x_5)]
C45  4n7  [B32021_(13_x_5)]
D1  10A6  [10A6]
D2  1N4148W-7-F  [SOD-123]
DB1  Component_1  [GBJ2506]
F1  Fuse  [FUSE]
IC2  2N7002E-7-F  [DIODES SOT-23-3]
L3  SC-18-25J  [SC18-25J]
Q1  STGW30NC60KD  [STGW30NC60KD]
R22  470 Ohms  [RES 0805_2012]
R23  PRM05WJP333  [prmaawjw470b00]
R24  PRM05WJP333  [prmaawjw470b00]
R25  47 Ohms  [RES 0805_2012]
R26  10 kOhms  [RES 0805_2012]
R27  1M  [RESAD2400W75L1000D350]
R28  PRMAAWJW470B00  [prmaawjw470b00]
R29  470 Ohms  [RES 0805_2012]
RL1  G2R-1A-E  [G2R-1A-E]
RV1  SIOV-S20K275  [B72220Q0271K101]
U16  TLP701  [TLP701]

### Nets
+15_HOT: C37.2 U16.6(Vcc)
+24: D2.2 RL1.2
EARTH: C41.2 C42.1 C44.2 C45.1
GND: IC2.2(S) U16.3(K)
GNDH: C37.1 C39.2 C40.2 C43.1 C45.2 DB1.4(-) Q1.3(E) R23.1 R24.1 R26.1 U16.4(GND)
+Ug: C39.1 C40.1 C43.2 D1.K R23.2 R24.2 R28.2 RL1.4
AC-L: F1.1
AC-N: L3.1 RV1.1
B-: D1.A Q1.2(C)
BRAKE: R22.1
P0: DB1.1(+)
P1: C44.1 R28.1 RL1.3
Softstart: R29.1
NetC38_1: C38.1 C41.1 DB1.2 L3.4 R27.2
NetC38_2: C38.2 C42.2 DB1.3 L3.2 R27.1
NetD2_1: D2.1 IC2.3(D) RL1.1
NetF1_2: F1.2 L3.3 RV1.2
NetIC2_1: IC2.1(G) R29.2
NetQ1_1: Q1.1(G) R25.2 R26.2
NetR22_2: R22.2 U16.1(A)
NetR25_1: R25.1 U16.5(OUT)

### Notes on the sheet
- (near R28) 25J start energy in resistor
- (near R28) >1s to switch on relay
- 350V-60V in 60 sec
- 7W dissipation @ 350VDC
- Title
- Size:
- Date:
- A4
- Number:
- Time:
- Revision:
- Sheet
- of
- File:

### Library data of the parts
C37 = C2012X7R1V225K125AB: as C1 on sheet igbt_output; Part Number: C2012X7R1V225K125AB; Value: 2.2 µF; Applications: General Purpose; Capacitance: 2.2 µF; componentlink1description: Datasheet; componentlink1url: https://product.tdk.com/info/en/catalog/datasheets/mlcc_commercial_general_en.pdf?ref_disty=digikey; componentlink2description: DigiKey Link; componentlink2url: https://www.digikey.com/en/products/detail/tdk-corporation/C2012X7R1V225K125AB/2732986; Device Package: 0805 (2012 Metric); lastupdated: 03.01.2023 20:10:54; Lifecycle Status: Active; Minimum Order: 1; Mounting Type: Surface Mount, MLCC; Operating Temperature: -55°C ~ 125°C; Package / Case: 0805 (2012 Metric); packaging: TapeAndReel; partid: 3412; Part Status: Active; price: 0.12; series: C; Size / Dimension: 0.079" L x 0.049" W (2.00mm x 1.25mm); Supplier 1: DigiKey; Supplier Part Number 1: 445-7551-1-ND; Temperature Coefficient: X7R; Thickness (Max): 0.057" (1.45mm); Voltage - Rated: 35V; Features: Low ESL
C38 = R46KI347050M1K: KEMET R46KI347050M1K; Datasheet Link: https://content.kemet.com/datasheets/KEM_F3093_R46_X2_275_110C.pdf; Height: 19.1mm; Manufacturer_Name: KEMET; Manufacturer_Part_Number: R46KI347050M1K; Mouser Part Number: 80-R46KI347050M1K; Mouser Price/Stock: https://www.mouser.co.uk/ProductDetail/KEMET/R46KI347050M1K?qs=D0iH%252BVFiYPOUls74bzoCnw%3D%3D; Arrow Part Number: R46KI347050M1K; Arrow Price/Stock: https://www.arrow.com/en/products/r46ki347050m1k/kemet-corporation
C39 C40 = 450HXG470MEFCSN35X45: CAP ALUM 470UF 20% 450V SNAP; manufacturer: Rubycon; Lifetime @ Temp.: 3000 Hrs @ 105°C; Polarization: Polar; Ripple Current @ High Frequency: 4.088A @ 10kHz; Ripple Current @ Low Frequency: 2.92A @ 120Hz; Part Number: 450HXG470MEFCSN35X45; Applications: General Purpose; Capacitance: 470µF; componentlink1description: Datasheet; componentlink1url: http://www.rubycon.co.jp/en/catalog/e_pdfs/aluminum/e_HXG.pdf; componentlink2description: DigiKey Link; componentlink2url: http://digikey.com/product-detail/en/rubycon/450HXG470MEFCSN35X45/1189-1975-ND/3986874; Device Package: Radial, Can - Snap-In; Height - Seated (Max): 1.850" (47.00mm); lastupdated: 29.09.2020 01:08:39; Lead Spacing: 0.394" (10.00mm); Lifecycle Status: Active; Minimum Order: 1; Mounting Type: Through Hole; Operating Temperature: -25°C ~ 105°C; Package / Case: Radial, Can - Snap-In; packaging: Bulk; partid: 26666; Part Status: Active; price: 8.55; series: HXG; Size / Dimension: 1.378" Dia (35.00mm); Supplier 1: DigiKey; Supplier Part Number 1: 1189-1975-ND; Tolerance: ±20%; value: 470µF; Voltage - Rated: 450V
C41 C42 C44 C45 = B32021A3472K289: B32021A3472; Manufacturer_Name: TDK; Datasheet Link: https://product.tdk.com/system/files/dam/doc/product/capacitor/film/emi/data_sheet/20/20/db/fc_2009/y2_b32021_026.pdf; Manufacturer_Part_Number: B32021A3472K289; Mouser Part Number: 871-B32021A3472K289; Mouser Price/Stock: https://www.mouser.co.uk/ProductDetail/EPCOS-TDK/B32021A3472K289?qs=FNSAlmj86E3UPc1%2F593FMg%3D%3D; Arrow Part Number: B32021A3472K289; Arrow Price/Stock: https://www.arrow.com/en/products/b32021a3472k289/epcos-tdk
D2 = 1N4148W-7-F: DIODE GEN PURP 100V 300MA SOD123; Manufacturer: Diodes Incorporated; Capacitance @ Vr, F: 2pF @ 0V, 1MHz; Current - Average Rectified (Io): 300mA (DC); Current - Reverse Leakage @ Vr: 1 µA @ 100 V; Diode Type: Standard; Reverse Recovery Time (trr): 4 ns; Speed: Small Signal =< 200mA (Io), Any Speed; Voltage - Forward (Vf) (Max) @ If: 1.25 V @ 150 mA; Part Number: 1N4148W-7-F; ComponentLink1Description: Datasheet; ComponentLink1URL: https://www.diodes.com/assets/Datasheets/ds30086.pdf; ComponentLink2Description: DigiKey Link; ComponentLink2URL: https://www.digikey.com/en/products/detail/diodes-incorporated/1N4148W-7-F/814371; LastUpdated: 02.01.2023 20:53:45; Lifecycle Status: Active; Minimum Order: 1; Mounting Type: Surface Mount; Operating Temperature - Junction: -55°C ~ 150°C; Package / Case: SOD-123; Packaging: TapeAndReel; PartId: 1002; Part Status: Active; Price: 0.02; Series: -; Supplier 1: DigiKey; Supplier Part Number 1: 1N4148W-FDICT-ND; Supplier Device Package: SOD-123; Voltage - DC Reverse (Vr) (Max): 100 V
F1 = Fuse: Fuse holder 04450001N
IC2 = 2N7002E-7-F: MOSFET N-CH 60V 0.25A SOT23-3; Manufacturer: Diodes Incorporated; Current - Continuous Drain (Id) @ 25°C: 250mA (Ta); Drive Voltage (Max Rds On,  Min Rds On): 4.5V, 10V; FET Type: N-Channel; Gate Charge (Qg) (Max) @ Vgs: 0.22nC @ 4.5V; Input Capacitance (Ciss) (Max) @ Vds: 50pF @ 25V; Power Dissipation (Max): 370mW (Ta); Rds On (Max) @ Id, Vgs: 3Ohm @ 250mA, 10V; Vgs (Max): ±20V; Vgs(th) (Max) @ Id: 2.5V @ 250µA; Part Number: 2N7002E-7-F; ComponentLink1Description: Datasheet; ComponentLink1URL: https://www.diodes.com/assets/Datasheets/ds30376.pdf; ComponentLink2Description: DigiKey Link; ComponentLink2URL: http://digikey.com/product-detail/en/diodes-incorporated/2N7002E-7-F/2N7002E-FDICT-ND/3877406; Drain to Source Voltage (Vdss): 60V; LastUpdated: 02.01.2023 21:04:52; Lifecycle Status: Active; Minimum Order: 1; Mounting Type: Surface Mount; Operating Temperature: -55°C ~ 150°C (TJ); Package / Case: TO-236-3, SC-59, SOT-23-3; Packaging: TapeAndReel; Part Status: Active; Price: 0.05; Series: -; Supplier 1: DigiKey; Supplier Part Number 1: 2N7002E-FDICT-ND; Supplier Device Package: SOT-23-3; Technology: MOSFET (Metal Oxide)
L3 = SC-18-25J: https://www.tme.eu/pl/details/sc-18-25j/dlawiki-pierscieniowe/kemet/
R22 R29 = ERJ-PB6B4700V: as R1 on sheet igbt_output; Part Number: ERJ-PB6B4700V; Value: 470 Ohms; ComponentLink1Description: Datasheet; ComponentLink1URL: https://industrial.panasonic.com/cdbs/www-data/pdf/RDM0000/AOA0000C328.pdf; ComponentLink2Description: DigiKey Link; ComponentLink2URL: https://www.digikey.com/en/products/detail/panasonic-electronic-components/ERJ-PB6B4700V/6213339; Composition: Thick Film; Device Package: 0805 (2012 Metric); Features: Automotive AEC-Q200, Pulse Withstanding; Height - Seated (Max): 0.028" (0.70mm); LastUpdated: 02.01.2023 20:44:49; Lifecycle Status: Active; Minimum Order: 1; Number of Terminations: 2; Operating Temperature: -55°C ~ 155°C; Package / Case: 0805 (2012 Metric); Packaging: TapeAndReel; PartId: 28402; Part Status: Active; Price: 0.04; Ratings: AEC-Q200; Resistance: 470 Ohms; Series: ERJ-PB6; Size / Dimension: 0.079" L x 0.049" W (2.00mm x 1.25mm); Supplier 1: DigiKey; Supplier Part Number 1: P20556CT-ND; Supplier Device Package: 0805; Tolerance: ±0.1%
R25 = CRGP0805F47R: as R9 on sheet igbt_output; Part Number: CRGP0805F47R; Value: 47 Ohms; ComponentLink1Description: Datasheet; ComponentLink1URL: https://www.te.com/commerce/DocumentDelivery/DDEController?Action=srchrtrv&DocNm=9-1773463-9&DocType=DS&DocLang=English; ComponentLink2Description: DigiKey Link; ComponentLink2URL: https://www.digikey.com/en/products/detail/te-connectivity-passive-product/CRGP0805F47R/8577063; Composition: Thick Film; Device Package: 0805 (2012 Metric); Features: Pulse Withstanding; Height - Seated (Max): 0.026" (0.65mm); LastUpdated: 02.01.2023 20:44:48; Lifecycle Status: Active; Minimum Order: 1; Number of Terminations: 2; Operating Temperature: -55°C ~ 155°C; Package / Case: 0805 (2012 Metric); Packaging: TapeAndReel; PartId: 28763; Part Status: Active; Price: 0.03; Resistance: 47 Ohms; Series: CRGP; Size / Dimension: 0.079" L x 0.049" W (2.00mm x 1.25mm); Supplier 1: DigiKey; Supplier Part Number 1: A130461CT-ND; Supplier Device Package: 0805; Tolerance: ±1%
R26 = RNCS0805BKE10K0: RES 10K OHM 0.1% 1/10W 0805; Manufacturer: Stackpole Electronics Inc; Power (Watts): 0.1W, 1/10W; Temperature Coefficient: ±25ppm/°C; Part Number: RNCS0805BKE10K0; Value: 10 kOhms; ComponentLink1Description: Datasheet; ComponentLink1URL: https://www.seielect.com/catalog/sei-rncs_rnch.pdf; ComponentLink2Description: DigiKey Link; ComponentLink2URL: https://www.digikey.com/en/products/detail/stackpole-electronics-inc/RNCS0805BKE10K0/1800067; Composition: Thin Film; Device Package: 0805 (2012 Metric); Features: Anti-Corrosive, Automotive AEC-Q200, Moisture Resistant; Height - Seated (Max): 0.026" (0.65mm); LastUpdated: 02.01.2023 20:44:52; Lifecycle Status: Active; Minimum Order: 1; Number of Terminations: 2; Operating Temperature: -55°C ~ 155°C; Package / Case: 0805 (2012 Metric); Packaging: TapeAndReel; PartId: 27713; Part Status: Active; Price: 0.09; Ratings: AEC-Q200; Resistance: 10 kOhms; Series: RNCS; Size / Dimension: 0.079" L x 0.049" W (2.00mm x 1.25mm); Supplier 1: DigiKey; Supplier Part Number 1: RNCS0805BKE10K0CT-ND; Supplier Device Package: 0805; Tolerance: ±0.1%
R27 = ROX1SJ330K: Resistor; Manufacturer_Name: TE Connectivity; Datasheet Link: http://www.te.com/commerce/DocumentDelivery/DDEController?Action=showdoc&DocId=Data+Sheet%7F1773271%7FE%7Fpdf%7FEnglish%7FENG_DS_1773271_E.pdf%7F1625886-2; Manufacturer_Part_Number: ROX1SJ330K; Mouser Part Number: 279-ROX1SJ330K; Mouser Price/Stock: http://www.mouser.com/Search/ProductDetail.aspx?qs=ip69W3eHERVe%2fUOZ1paVUg%3d%3d
R28 = PRMAAWJW470B00: https://www.tme.eu/pl/details/ax10wv-47r/rezystory-mocy/royal-ohm/prmaawjw470b00/
RL1 = G2R-1A-E: https://www.tme.eu/pl/details/g2r-1a-e-24dc/przekazniki-elektromagn-miniaturowe/omron-ocb/g2r-1a-e-24vdc/
RV1 = B72220Q0271K101: B72220S0271K101; Manufacturer_Name: TDK; Datasheet Link: https://product.tdk.com/system/files/dam/doc/product/protection/voltage/lead-disk-varistor/data_sheet/70/db/var/siov_leaded_energetiq.pdf; Height: 27mm; Manufacturer_Part_Number: B72220Q0271K101; Mouser Part Number: 871-B72220Q271K101; Mouser Price/Stock: https://www.mouser.co.uk/ProductDetail/EPCOS-TDK/B72220Q0271K101?qs=dEfas%2FXlABKTVg%252B2uP1HuA%3D%3D; Arrow Part Number: B72220Q0271K101; Arrow Price/Stock: https://www.arrow.com/en/products/b72220q0271k101/epcos-tdk

## Nets that join several sheets
+3V3: servo_pwr (J5.19), igbt_output (6 pins)
+5: servo_pwr (J5.2), igbt_output (C2.2 TP1.1 U2.1)
+15_HOT: igbt_output (10 pins), DClink (C37.2 U16.6)
+24: servo_pwr (J5.1 J6.1), DClink (D2.2 RL1.2)
EARTH: servo_pwr (J2.3 J3.1 MH3.1 MH4.1), DClink (C41.2 C42.1 C44.2 C45.1)
GND: servo_pwr (J5.11 J5.20 J6.2), igbt_output (24 pins), DClink (IC2.2 U16.3)
GNDH: servo_pwr (J4.3), igbt_output (38 pins), DClink (11 pins)
+Ug: servo_pwr (J1.1), igbt_output (IPM1.26 R15.2), DClink (8 pins)
AC-L: servo_pwr (J3.2), DClink (F1.1)
AC-N: servo_pwr (J3.3), DClink (L3.1 RV1.1)
ADC_CLK: servo_pwr (J5.14), igbt_output (R21.1)
ADC_CS: servo_pwr (J5.13), igbt_output (R20.1)
ADC_MISO: servo_pwr (J5.8), igbt_output (U9.5)
ADC_MOSI: servo_pwr (J5.9), igbt_output (R13.1)
B-: servo_pwr (J10.1), DClink (D1.A Q1.2)
BRAKE: servo_pwr (J5.3), DClink (R22.1)
HinU: servo_pwr (J5.4), igbt_output (R6.1)
HinV: servo_pwr (J5.5), igbt_output (R3.1)
HinW: servo_pwr (J5.6), igbt_output (R4.1)
I_U: servo_pwr (J5.10), igbt_output (C28.2 TP14.1 U10.7)
I_V: servo_pwr (J5.12), igbt_output (C32.2 TP16.1 U12.7)
IGBT_flt: servo_pwr (J5.7), igbt_output (U1.5)
LinU: servo_pwr (J5.17), igbt_output (R5.1)
LinV: servo_pwr (J5.16), igbt_output (R1.1)
LinW: servo_pwr (J5.15), igbt_output (R2.1)
P0: servo_pwr (J4.1), DClink (DB1.1)
P1: servo_pwr (J4.2), DClink (C44.1 R28.1 RL1.3)
Softstart: servo_pwr (J5.18), DClink (R29.1)
U_phase: servo_pwr (J1.3), igbt_output (U10.3 U10.4)
V_phase: servo_pwr (J2.1), igbt_output (U12.3 U12.4)
W_phase: servo_pwr (J2.2), igbt_output (IPM1.23)